# EAGLE design eagle 8 test (EAGLE 8.0.0)
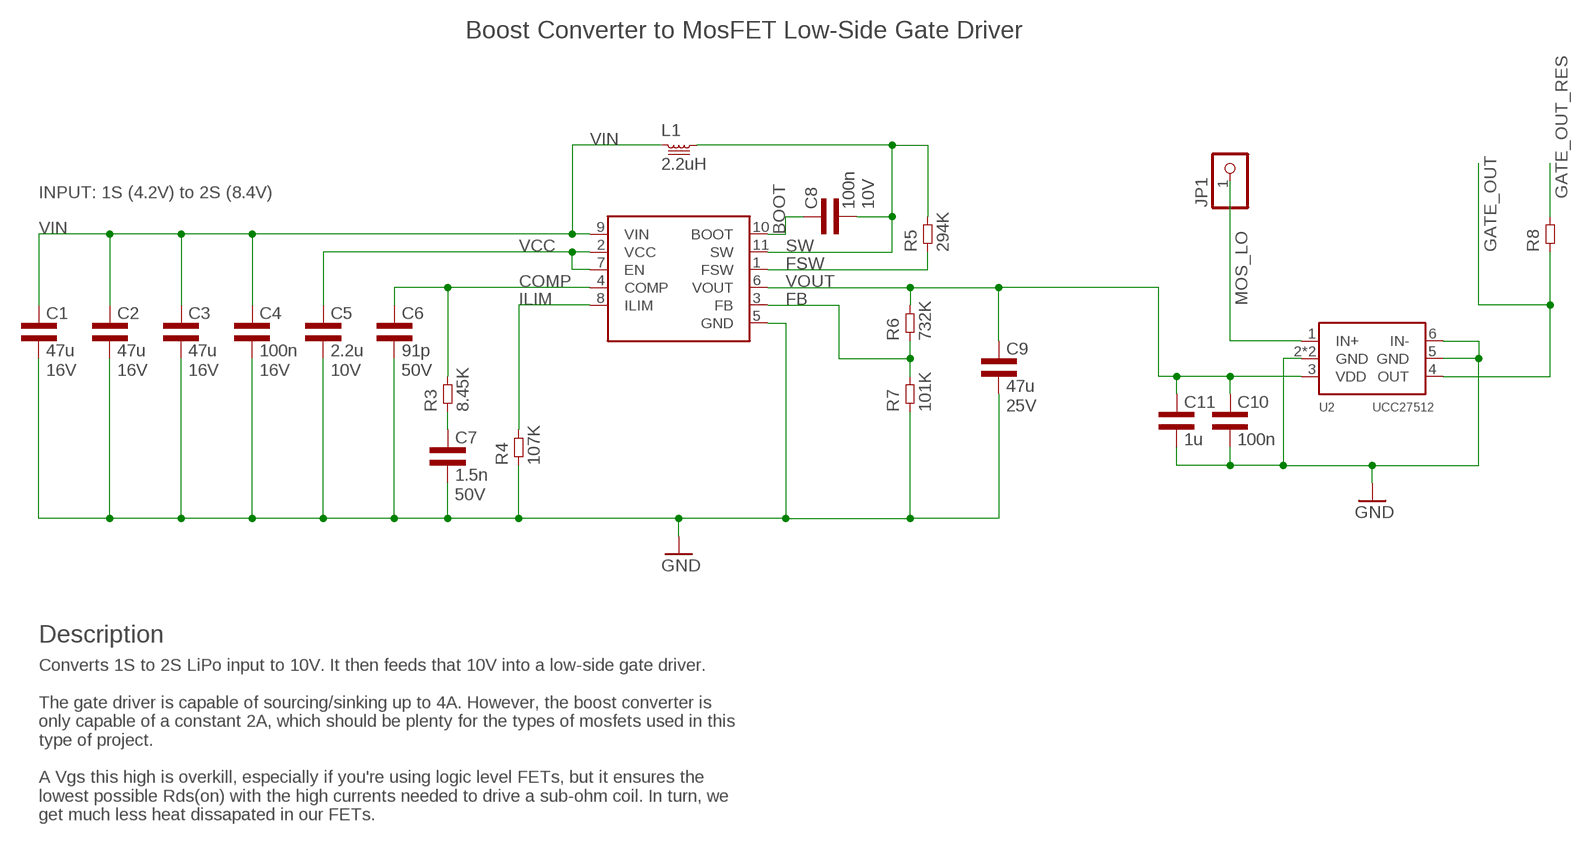
[diagram p0: schematic, sheet 1]

## Parts
C1  47u  CAP1210L3  [1210L3]
C2  47u  CAP1210L3  [1210L3]
C3  47u  CAP1210L3  [1210L3]
C4  100n  CAP0402L3  [0402L3]
C5  2.2u  CAP0603L3  [0603L3]
C6  91p  CAP0805L3  [0805L3]
C7  1.5n  CAP0805L3  [0805L3]
C8  100n  CAP0402L3  [0402L3]
C9  47u  CAP1206L3  [1206L3]
C10  100n  CAP0603L3  [0603L3]
C11  1u  CAP0805L3  [0805L3]
JP1  PINHD-1X1  [1X01]
L1  2.2uH  INDUCTOR9.2X8.5  [9.2X8.5]
R3  8.45K  RES0402L3  [0402L3]
R4  107K  RES1206L3  [1206L3]
R5  294K  RES1206L3  [1206L3]
R6  732K  RES0402L3  [0402L3]
R7  101K  RES0805L3  [0805L3]
R8  RES1206L3  [1206L3]
U1  TPS61089  [VQFN-11]
U2  UCC27512  [S-PWSON-N6]

## Nets
BOOT: C8.P$1 U1.10(BOOT)
COMP: C6.1 R3.P$2 U1.4(COMP)
COMP_RES: C7.1 R3.P$1
FB: R6.P$1 R7.2 U1.3(FB)
FSW: R5.1 U1.1(FSW)
GATE_OUT: R8.1 U2.4(OUT)
GATE_OUT_RES: R8.2
GND: C1.P$2 C2.P$2 C3.P$2 C4.P$2 C5.P$2 C6.2 C7.2 C9.2 C10.P$2 C11.2 R4.1 R7.1 U1.5(GND) U2.2(GND) U2.5(GND) U2.6(IN-) U2.TP(GND)
ILIM: R4.2 U1.8(ILIM)
MOS_LO: JP1.1 U2.1(IN+)
SW: C8.P$2 L1.2 R5.2 U1.11(SW)
VCC: C5.P$1 U1.2(VCC) U1.7(EN)
VIN: C1.P$1 C2.P$1 C3.P$1 C4.P$1 L1.1 U1.9(VIN)
VOUT: C9.1 C10.P$1 C11.1 R6.P$2 U1.6(VOUT) U2.3(VDD)

## Notes on the sheet
- Boost Converter to MosFET Low-Side Gate Driver
- INPUT: 1S (4.2V) to 2S (8.4V)
- Description
- Converts 1S to 2S LiPo input to 10V. It then feeds that 10V into a low-side gate driver.
  
  The gate driver is capable of sourcing/sinking up to 4A. However, the boost converter is 
  only capable of a constant 2A, which should be plenty for the types of mosfets used in this 
  type of project.
  
  A Vgs this high is overkill, especially if you're using logic level FETs, but it ensures the
  lowest possible Rds(on) with the high currents needed to drive a sub-ohm coil. In turn, we 
  get much less heat dissapated in our FETs.

## Library data of the parts
C1-C4 = common:CAP; VOLTAGE: 16V
C5 C8 = common:CAP; VOLTAGE: 10V
C6 C7 = common:CAP; VOLTAGE: 50V
C9 = common:CAP; VOLTAGE: 25V
C10 C11 = common:CAP
JP1 = pinhead:PINHD-1X1: PIN HEADER
L1 = common:INDUCTOR
R3-R8 = common:RES
U1 = common:TPS61089
U2 = micro-stm_v3:UCC27512

## Board
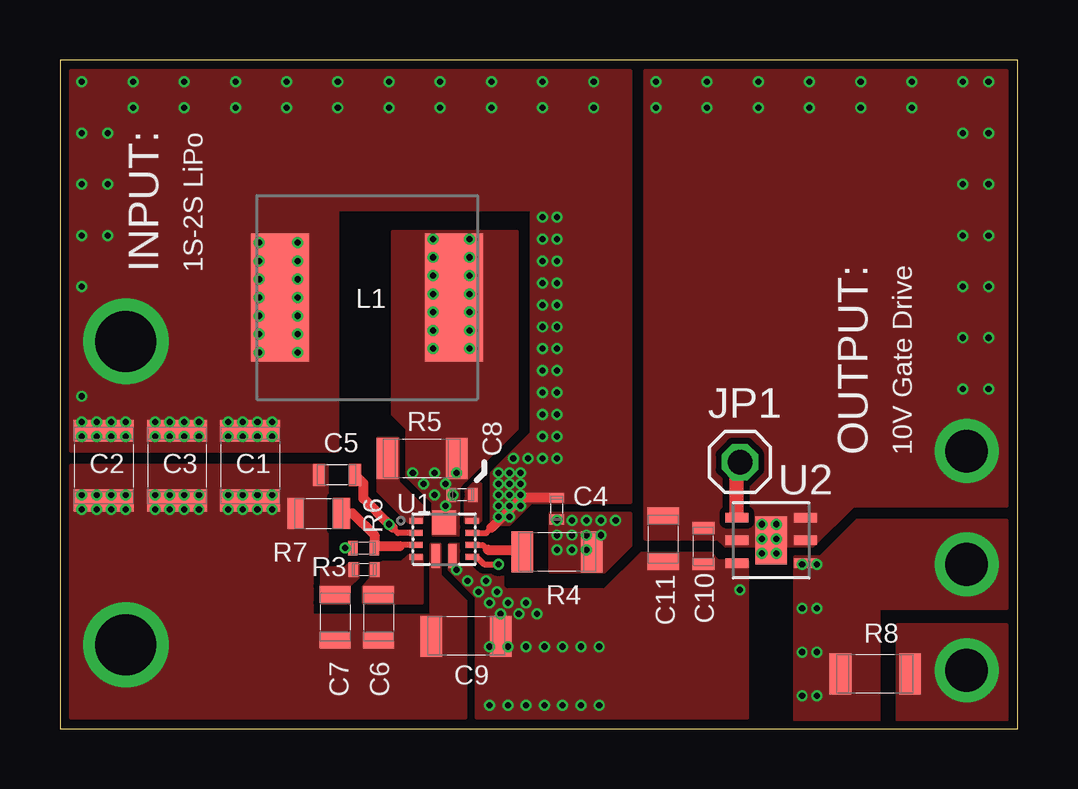
[diagram p1: board, top side]
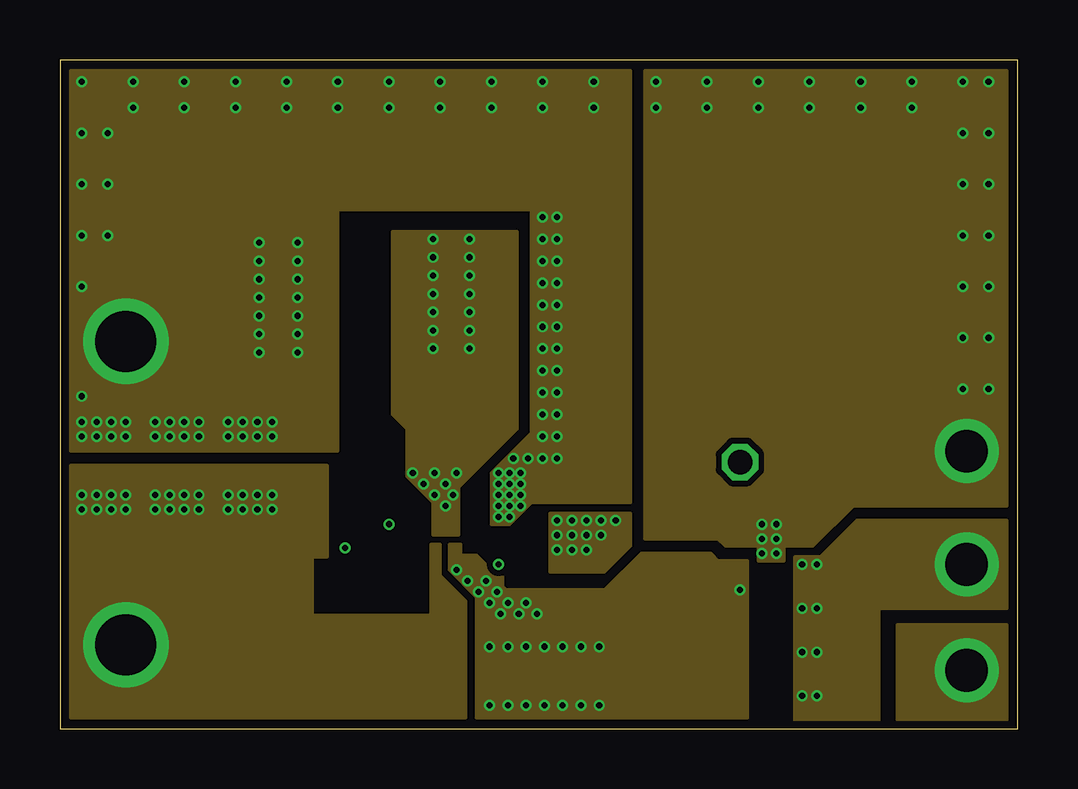
[diagram p2: board, inner layer Route2]
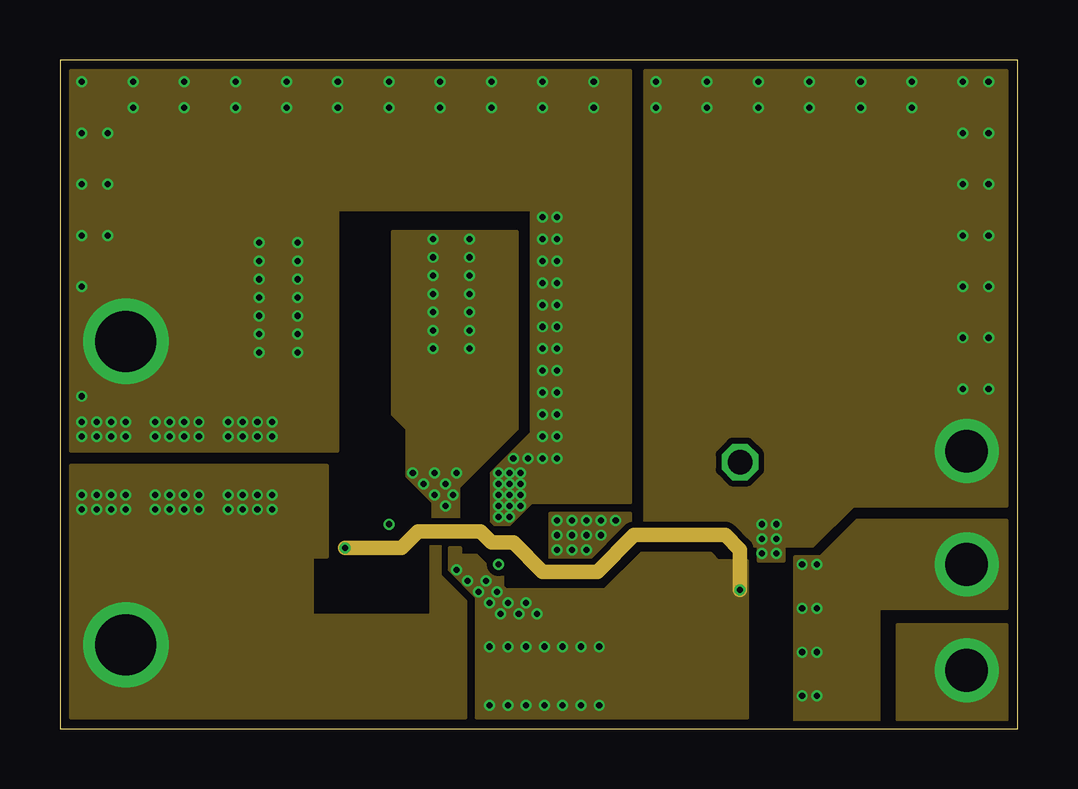
[diagram p3: board, inner layer Route3]
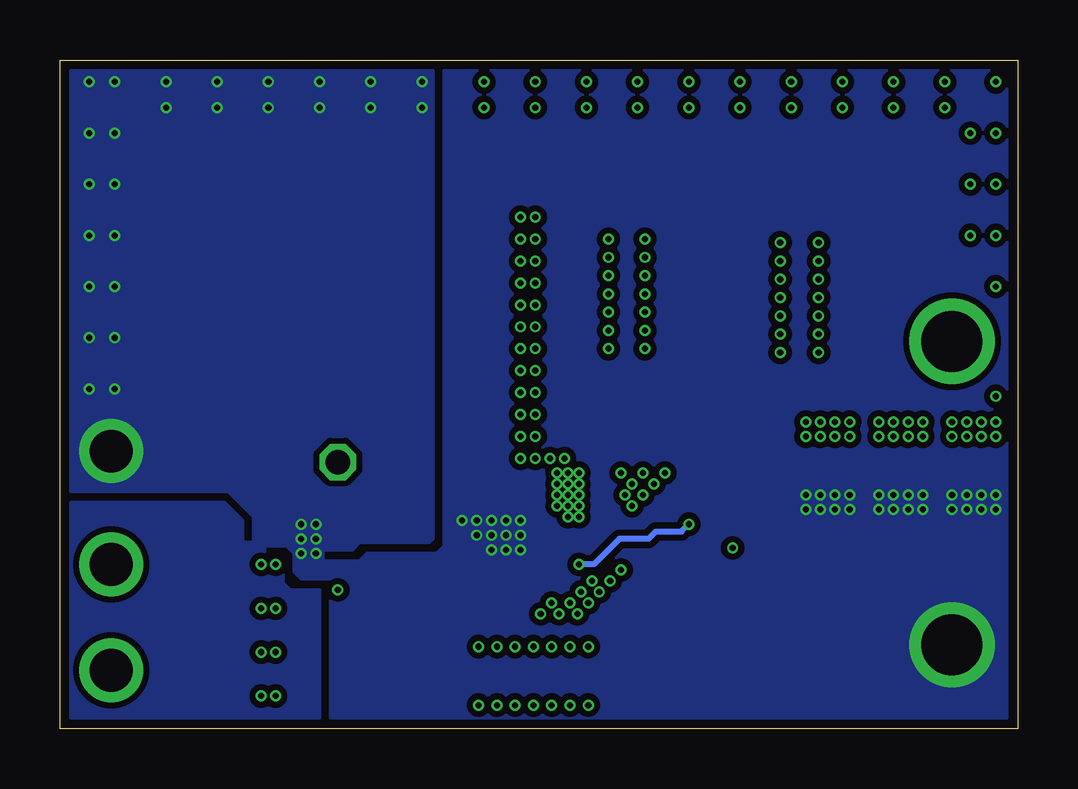
[diagram p4: board, bottom side, seen from below]

Size 39.93 x 27.89 mm. Coordinates in mm from the lower left corner, seen from the top.
Outline: 0,27.89 0,0 39.93,0 39.93,27.89 0,27.89
Copper layers (1*2*3*16): Top 0.035mm / dielectric 1.5mm / Route2 0.035mm / dielectric 0.15mm / Route3 0.035mm / dielectric 0.2mm / Bottom 0.035mm
Design rules "test *": minimum track width 6mil, minimum drill 10mil, track to track 10mil, track to pad 10mil, pad to pad 10mil, via to via 10mil, smd to smd 0mil, copper to edge 13mil, drill to drill 10mil, minimum pad ring 4mil, minimum via ring 4mil, stop-mask expansion 4mil, vias tented up to drill 22mil, thermal gap 10mil

### Footprints (pad centres in the part's own frame; a part is rotated, then mirrored left to right if it is on the bottom)
1210L3 = smd 0.9 x 2.5: P$1 -1.45,0; P$2 1.45,0
0402L3 = smd 0.4 x 0.6: P$1 -0.45,0; P$2 0.45,0
0603L3 = smd 0.5 x 0.9: P$1 -0.75,0; P$2 0.75,0
0805L3 = smd 0.7 x 1.3: 1 -0.95,0; 2 0.95,0
1206L3 = smd 0.9 x 1.7: 1 -1.45,0; 2 1.45,0
1X01 = drill 1.016 octagon: 1 0,0
9.2X8.5 = smd 2.42 x 5.33: 1 -3.62,0; 2 3.62,0
VQFN-11 = smd 0.55 x 0.25: 1 -1.175,0.75; 2 -1.175,0.25; 3 -1.175,-0.25; 4 -1.175,-0.75; 7 1.175,-0.75; 8 1.175,-0.25; 9 1.175,0.25; 10 1.175,0.75 | smd 0.35 x 1: 5 -0.35,-0.7; 6 0.35,-0.7 | smd 1 x 1: 11 0,0.7
S-PWSON-N6 = smd 0.4 x 0.95: 1 -0.95,-1.425; 2 0,-1.425; 3 0.95,-1.425; 4 0.95,1.425; 5 0,1.425; 6 -0.95,1.425 | smd 2 x 1.3: TP 0,0

### Placement (x,y rotation side)
C1  7.92,10.97 270 top
C2  1.83,10.97 270 top
C3  4.88,10.97 270 top
C4  20.71,9.18 270 top
C5  11.55,10.59 180 top
C6  13.28,4.65 270 top
C7  11.47,4.65 270 top
C8  16.76,9.75 180 top
C9  16.93,3.86 180 top
C10  26.82,7.62 90 top
C11  25.15,7.92 90 top
JP1  28.35,11.13 0 top
L1  12.8,17.98 0 top
R3  12.68,6.64 0 top
R4  20.72,7.38 180 top
R5  15.09,11.28 0 top
R6  12.65,7.53 180 top
R7  10.79,8.98 0 top
R8  33.98,2.3 0 top
U1  16.02,7.91 0 top
U2  29.64,7.86 270 top

### Tracks (layer width: path | path; a pad name or v marks a point on that pad's centre or on a via)
BOOT
  pour Top (no thermals): 16.92,8.61 16.92,9.91 17.22,10.21 17.53,10.21 17.53,8.69 17.45,8.61
COMP
  pour Top (no thermals): 15.09,7.24 14.55,7.24 14.25,6.93 12.95,6.93 12.95,6.25 12.65,5.94 12.65,5.26 15.09,5.26
COMP_RES
  pour Top (no thermals): 12.42,6.93 12.12,6.93 11.89,6.71 10.9,6.71 10.9,5.26 12.04,5.26 12.04,5.94 12.42,6.32
FB
  Top 0.254: U1.3 14.22,7.66 14.17,7.62
  Top 0.406: 13.2,7.62 14.17,7.62 | 13.2,7.62 R6.P$1 | R7.2 12.19,8.99 13.11,8.08 13.11,7.71 13.2,7.62
FSW
  pour Top (no thermals): 15.09,8.61 14.55,8.61 13.26,9.91 13.26,12.12 14.1,12.12 14.1,10.29 15.09,9.3
GATE_OUT  (via drill 0.25, 1.78)
  other vias: 37.8,6.86 30.94,6.86 31.55,6.86 30.94,5.03 31.55,5.03 30.94,3.2 31.55,3.2 30.94,1.37 31.55,1.37
  pour Top (no thermals): 30.63,7.16 31.7,7.16 33.22,8.69 39.47,8.69 39.47,5.03 34.14,5.03 34.14,0.3 30.63,0.3
  pour Top (no thermals): 30.63,7.16 31.7,7.16 33.22,8.69 39.47,8.69 39.47,5.03 34.14,5.03 34.14,0.3 30.63,0.3
  pour Route2 (no thermals): 30.63,7.16 31.7,7.16 33.22,8.69 39.47,8.69 39.47,5.03 34.14,5.03 34.14,0.3 30.63,0.3
  pour Route3 (no thermals): 30.63,7.16 31.7,7.16 33.22,8.69 39.47,8.69 39.47,5.03 34.14,5.03 34.14,0.3 30.63,0.3
GATE_OUT_RES  (via drill 1.78)
  other vias: 37.8,2.44
  pour Top (no thermals): 39.47,0.38 39.47,4.34 34.9,4.34 34.9,0.38
  pour Route2 (no thermals): 39.47,0.38 39.47,4.34 34.9,4.34 34.9,0.38
  pour Route3 (no thermals): 39.47,0.38 39.47,4.34 34.9,4.34 34.9,0.38
GND  (via drill 0.25, 1.78, 2.54)
  other vias: 20.73,8.08 20.73,7.47 20.73,8.69 21.34,8.69 21.95,8.69 22.56,8.69 23.16,8.69 21.34,8.08 21.34,7.47 37.8,11.58 2.74,3.51 21.95,8.08 22.56,8.08 21.95,7.47 24.84,26.97 24.84,25.91 26.97,26.97 29.11,26.97 31.24,26.97 33.38,26.97 26.97,25.91 29.11,25.91 31.24,25.91 33.38,25.91 35.51,26.97 37.64,26.97 38.71,26.97 35.51,25.91 38.71,24.84 38.71,22.71 38.71,20.57 38.71,18.44 38.71,16.31 38.71,14.17 37.64,24.84 37.64,22.71 37.64,20.57 37.64,18.44 37.64,16.31 37.64,14.17 29.26,8.53 29.87,8.53 29.26,7.92 29.87,7.92 29.26,7.32 29.87,7.32 0.91,9.75 0.91,9.14 1.52,9.75 2.13,9.75 2.74,9.75 1.52,9.14 2.13,9.14 2.74,9.14 3.96,9.75 4.57,9.75 5.18,9.75 5.79,9.75 3.96,9.14 4.57,9.14 5.18,9.14 5.79,9.14 7.01,9.75 7.62,9.75 8.23,9.75 8.84,9.75 8.84,9.14 8.23,9.14 7.62,9.14 7.01,9.14
  pour Top (no thermals): 15.47,7.7 15.47,4.72 10.52,4.72 10.52,7.16 11.13,7.16 11.13,10.97 0.46,10.97 0.46,0.46 16.92,0.46 16.92,5.33 15.85,6.4 15.85,7.7
  pour Top (no thermals): 30.18,7.01 30.18,7.62 31.39,7.62 33.07,9.3 39.47,9.3 39.47,27.43 24.38,27.43 24.38,7.92 27.43,7.92 27.74,7.62 29.11,7.62 29.11,7.01
  pour Top (no thermals): 20.42,8.99 20.42,6.55 22.71,6.55 23.77,7.62 23.77,8.99
  pour Route2 (no thermals): 30.18,7.01 30.18,7.62 31.39,7.62 33.07,9.3 39.47,9.3 39.47,27.43 24.38,27.43 24.38,7.92 27.43,7.92 27.74,7.62 29.11,7.62 29.11,7.01
  pour Route3 (no thermals): 30.18,7.01 30.18,7.62 31.39,7.62 33.07,9.3 39.47,9.3 39.47,27.43 24.38,27.43 24.38,7.92 27.43,7.92 27.74,7.62 29.11,7.62 29.11,7.01
  pour Route2 (no thermals): 15.47,7.7 15.47,4.72 10.52,4.72 10.52,7.16 11.13,7.16 11.13,10.97 0.46,10.97 0.46,0.46 16.92,0.46 16.92,5.33 15.85,6.4 15.85,7.7
  pour Route3 (no thermals): 15.47,7.7 15.47,4.72 10.52,4.72 10.52,7.16 11.13,7.16 11.13,10.97 0.46,10.97 0.46,0.46 16.92,0.46 16.92,5.33 15.85,6.4 15.85,7.7
  pour Route2 (no thermals): 20.42,8.99 20.42,6.55 22.71,6.55 23.77,7.62 23.77,8.99
  pour Route3 (no thermals): 20.42,8.99 20.42,6.55 22.71,6.55 23.77,7.62 23.77,8.99
  pour Bottom: 0.46,27.43 0.46,0.46 28.65,0.46 28.65,7.01 27.43,7.01 27.13,7.32 24.23,7.32 23.93,7.62 23.93,27.43
  pour Bottom: 28.5,7.01 28.96,7.01 28.96,7.47 27.74,7.47 27.43,7.77 24.54,7.77 24.38,7.92 24.38,27.43 39.47,27.43 39.47,9.91 32.92,9.91 31.85,8.84 31.85,7.77 32.31,7.77 32.31,8.69 33.07,9.45 39.47,9.45 39.47,0.46 29.11,0.46 29.11,5.79 30.33,5.79 30.63,6.1 30.63,7.01 30.78,7.16 31.39,7.16 31.39,7.62 30.48,7.62 30.18,7.32 30.18,6.55 29.87,6.25 28.5,6.25
ILIM
  Top 0.254: U1.8 17.63,7.66 17.83,7.47
  Top 0.406: 17.83,7.47 19.21,7.47 R4.2
MOS_LO
  Top 0.406: U2.1 28.22,8.97 28.19,8.99
  Top 0.61: 28.19,8.99 28.19,10.97 JP1.1
SW  (via drill 0.25)
  other vias: 15.54,20.42 15.54,19.66 15.54,18.9 15.54,18.14 15.54,17.37 15.54,16.61 15.54,15.85 17.07,15.85 17.07,16.61 17.07,20.42 17.07,19.66 17.07,18.9 17.07,18.14 17.07,17.37 16.08,9.3 15.62,9.75 15.16,10.21 14.71,10.67 15.62,10.67 16.08,10.21 16.38,9.75 16.54,10.67
  pour Top (no thermals): 15.54,8.08 15.54,9.45 14.48,10.52 14.48,12.5 13.87,13.11 13.87,20.73 19.05,20.73 19.05,12.5 16.61,10.06 16.61,8.08
  pour Route2 (no thermals): 15.54,8.08 15.54,9.45 14.48,10.52 14.48,12.5 13.87,13.11 13.87,20.73 19.05,20.73 19.05,12.5 16.61,10.06 16.61,8.08
  pour Route3 (no thermals): 15.54,8.08 15.54,9.45 14.48,10.52 14.48,12.5 13.87,13.11 13.87,20.73 19.05,20.73 19.05,12.5 16.61,10.06 16.61,8.08
VCC  (via drill 0.25 pad 0.25)
  Top 0.254: U1.2 14.09,8.16 13.87,8.38 | U1.7 17.37,7.16 17.68,6.86 v18.29,6.86
  Top 0.406: 13.87,8.38 v13.72,8.53 12.65,9.6 12.65,10.23 C5.P$1
  Bottom 0.254: v13.72,8.53 14.02,8.23 15.09,8.23 15.39,7.92 16.61,7.92 17.68,6.86 v18.29,6.86
VIN  (via drill 0.25, 2.54)
  Top 0.254: U1.9 17.77,8.16 17.98,8.38
  Top 0.406: C4.P$1 19.23,9.63 17.98,8.38
  other vias: 2.74,16.15 0.91,26.97 3.05,26.97 5.18,26.97 7.32,26.97 9.45,26.97 11.58,26.97 13.72,26.97 15.85,26.97 17.98,26.97 20.12,26.97 22.25,26.97 22.25,25.91 20.12,25.91 17.98,25.91 15.85,25.91 13.72,25.91 11.58,25.91 9.45,25.91 7.32,25.91 5.18,25.91 3.05,25.91 0.91,24.84 1.98,24.84 0.91,22.71 0.91,20.57 0.91,18.44 1.98,22.71 1.98,20.57 0.91,13.87 0.91,12.19 0.91,12.8 20.12,21.34 20.12,20.42 20.12,19.51 20.12,18.59 20.12,17.68 20.12,16.76 20.12,15.85 20.12,14.94 20.12,14.02 20.73,21.34 20.73,20.42 20.73,19.51 20.73,18.59 20.73,17.68 20.73,15.85 20.73,14.94 20.73,14.02 20.73,16.76 20.12,13.11 20.12,12.19 20.73,13.11 20.73,12.19 20.12,11.28 20.73,11.28 18.75,10.21 19.2,10.21 18.29,10.21 18.75,9.75 18.29,9.75 19.51,11.28 18.9,11.28 18.29,9.3 18.75,9.3 18.29,8.84 18.75,8.84 19.2,9.75 19.2,9.3 18.29,10.67 18.75,10.67 19.2,10.67 8.31,20.27 9.91,20.27 8.31,19.51 9.91,19.51 8.31,18.75 9.91,18.75 9.91,17.98 9.91,17.22 9.91,16.46 9.91,15.7 8.31,17.98 8.31,17.22 8.31,16.46 8.31,15.7 1.52,12.19 2.13,12.19 2.74,12.19 2.74,12.8 2.13,12.8 1.52,12.8 3.96,12.19 4.57,12.19 5.18,12.19 5.79,12.19 5.79,12.8 5.18,12.8 4.57,12.8 3.96,12.8 7.01,12.19 7.62,12.19 8.23,12.19 8.84,12.19 8.84,12.8 8.23,12.8 7.62,12.8 7.01,12.8
  pour Top (no thermals): 0.46,11.58 11.58,11.58 11.58,21.64 19.66,21.64 19.66,12.34 17.98,10.67 17.98,8.53 18.75,8.53 19.66,9.45 23.77,9.45 23.77,27.43 0.46,27.43
  pour Route2 (no thermals): 0.46,11.58 11.58,11.58 11.58,21.64 19.66,21.64 19.66,12.34 17.98,10.67 17.98,8.53 18.75,8.53 19.66,9.45 23.77,9.45 23.77,27.43 0.46,27.43
  pour Route3 (no thermals): 0.46,11.58 11.58,11.58 11.58,21.64 19.66,21.64 19.66,12.34 17.98,10.67 17.98,8.53 18.75,8.53 19.66,9.45 23.77,9.45 23.77,27.43 0.46,27.43
VOUT  (via drill 0.25, 0.25 pad 0.25)
  Top 0.406: R6.P$2 11.9,7.53 v11.89,7.54
  Route3 0.61: v11.89,7.54 14.25,7.54 14.94,8.23 17.53,8.23 17.98,7.77 18.9,7.77 20.12,6.55 22.4,6.55 23.93,8.08 27.74,8.08 28.35,7.47 v28.35,5.79
  other vias: 16.54,6.63 16.99,6.17 17.45,5.71 17.75,6.17 18.21,5.71 17.91,5.26 18.67,5.26 18.36,4.8 17.91,3.43 17.91,0.99 19.13,4.8 18.67,3.43 18.67,0.99 19.43,5.26 19.89,4.8 19.43,3.43 19.43,0.99 20.19,3.43 20.95,3.43 21.72,3.43 22.48,3.43 20.19,0.99 20.95,0.99 21.72,0.99 22.48,0.99
  pour Top (no thermals): 16.23,7.7 16.23,6.63 17.37,5.49 17.37,0.46 22.56,0.46 22.56,5.79 18.59,5.79 18.44,5.94 18.44,6.48 18.14,6.48 17.37,7.24 16.69,7.24 16.69,7.7
  pour Top (no thermals): 28.65,7.01 27.43,7.01 27.13,7.32 24.23,7.32 22.71,5.79 18.59,5.79 18.59,0.46 28.65,0.46
  pour Route2 (no thermals): 28.65,7.01 27.43,7.01 27.13,7.32 24.23,7.32 22.71,5.79 18.59,5.79 18.59,0.46 28.65,0.46
  pour Route3 (no thermals): 28.65,7.01 27.43,7.01 27.13,7.32 24.23,7.32 22.71,5.79 18.59,5.79 18.59,0.46 28.65,0.46
  pour Route2 (no thermals): 16.23,7.7 16.23,6.63 17.37,5.49 17.37,0.46 22.56,0.46 22.56,5.79 18.59,5.79 18.44,5.94 18.44,6.48 18.14,6.48 17.37,7.24 16.69,7.24 16.69,7.7
  pour Route3 (no thermals): 16.23,7.54 16.23,6.63 17.37,5.49 17.37,0.46 22.56,0.46 22.56,5.79 18.59,5.79 18.44,5.94 18.44,6.48 18.14,6.48 17.37,7.24 16.69,7.24 16.69,7.54

### Text on the board
tNames: INPUT: | 1S-2S LiPo | OUTPUT: | 10V Gate Drive